# EAGLE design Astable 555 Timer (EAGLE 9.6.2)
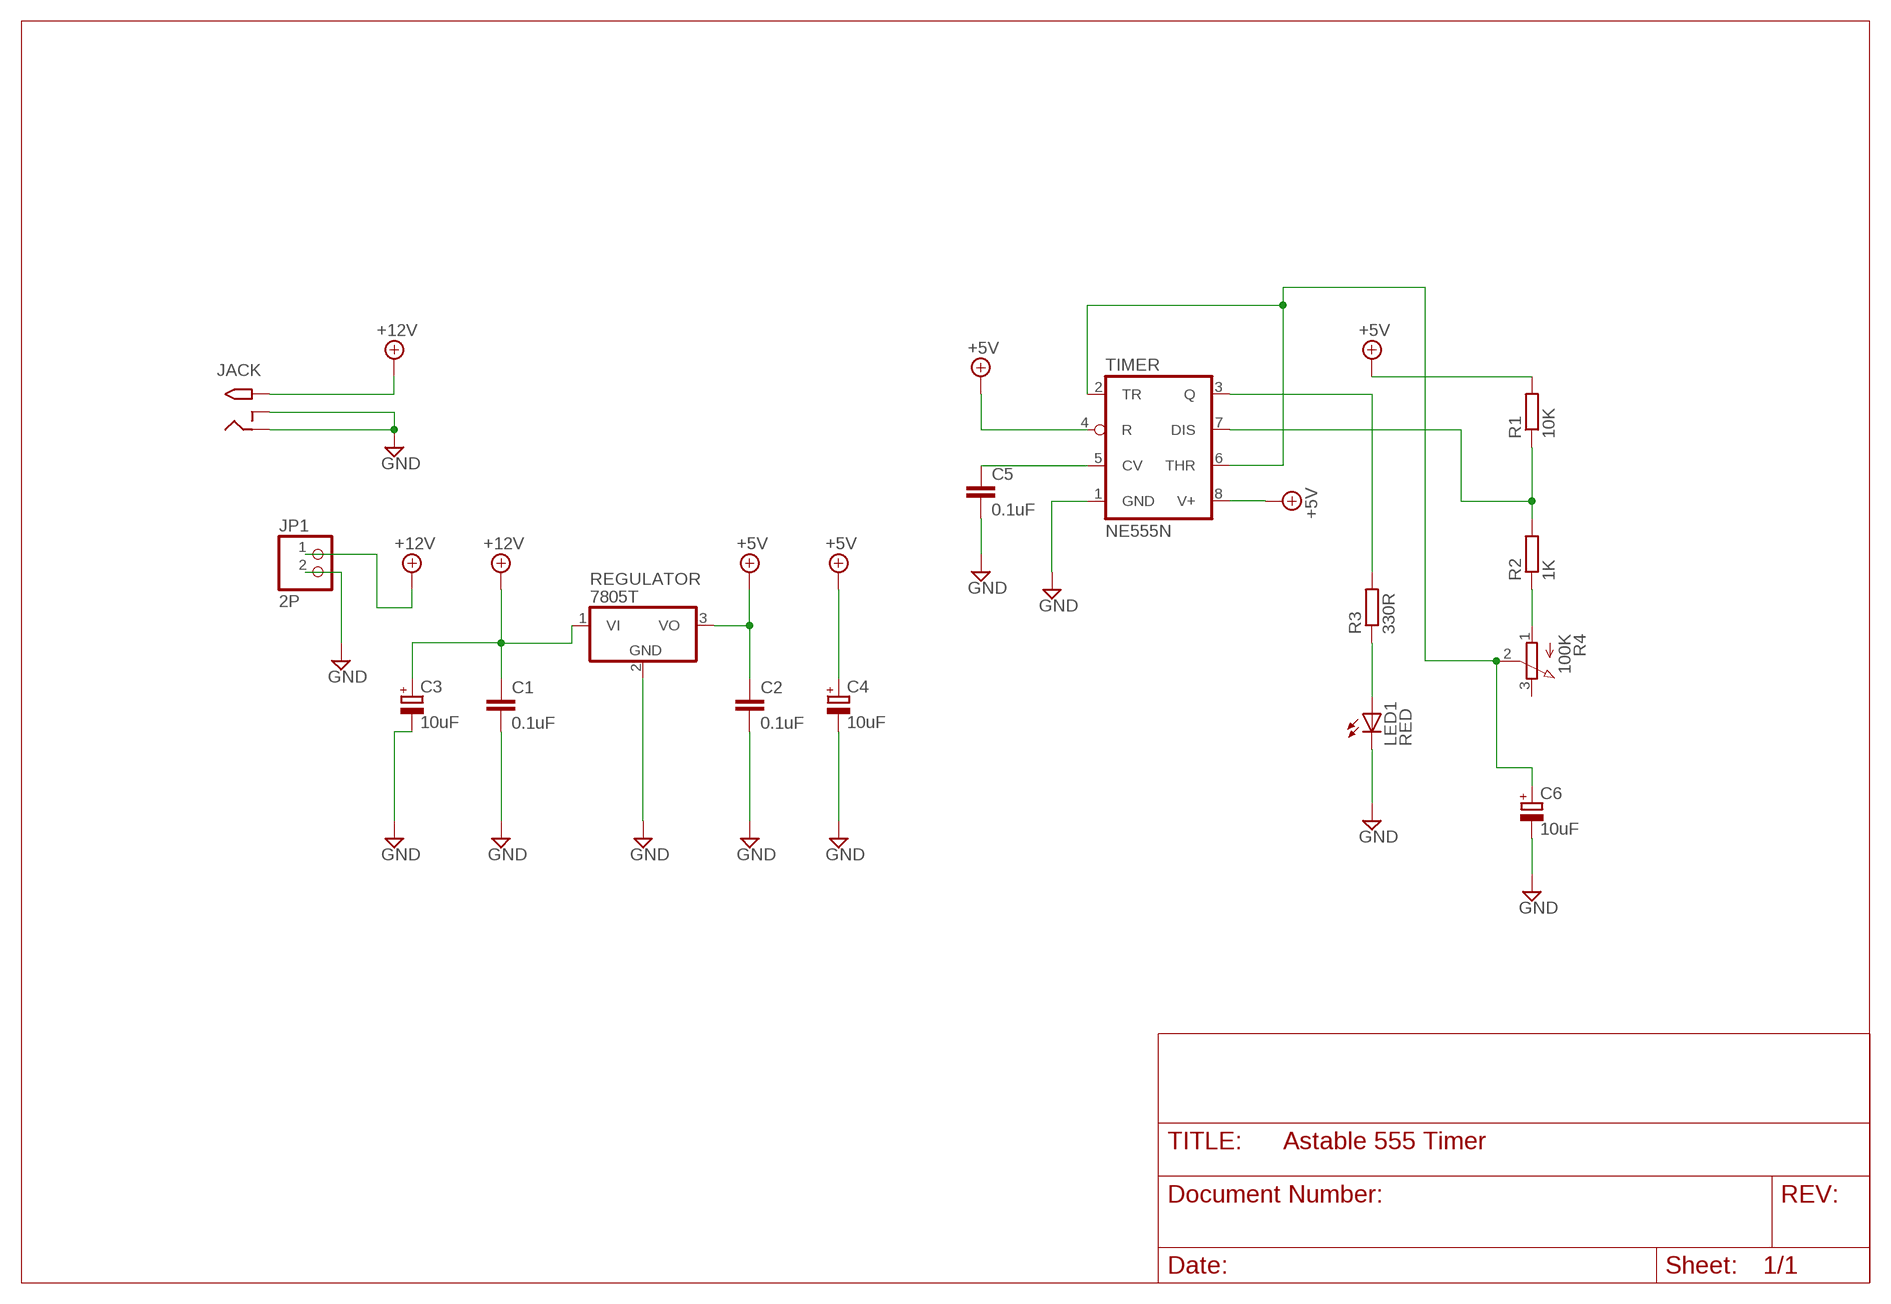
[diagram p0: schematic, sheet 1]

## Parts
C1  0.1uF  C-EU050-035X075  [C050-035X075]
C2  0.1uF  C-EU050-035X075  [C050-035X075]
C3  10uF  CPOL-EUE3.5-8  [E3,5-8]
C4  10uF  CPOL-EUE3.5-8  [E3,5-8]
C5  0.1uF  C-EU050-035X075  [C050-035X075]
C6  10uF  CPOL-EUE3.5-8  [E3,5-8]
JACK  2.1MMJACKTHM  [PJ-102A]
JP1  2P  PINHD-1X2  [1X02]
LED1  RED  LED5MM  [LED5MM]
R1  10K  R-EU_0207/15  [0207/15]
R2  1K  R-EU_0207/15  [0207/15]
R3  330R  R-EU_0207/15  [0207/15]
R4  100K  3RP/1610N  [3RP/1610N]
REGULATOR  7805T  [TO220H]
TIMER  NE555N  [DIL08-ROUND]

## Nets
+5V [POWER]: C2.1 C4.+ R1.2 REGULATOR.3(VO) TIMER.4(R) TIMER.8(V+)
+12V [POWER]: C1.1 C3.+ JACK.TIP JP1.1 REGULATOR.1(VI)
GND [POWER]: C1.2 C2.2 C3.- C4.- C5.2 C6.- JACK.RING JACK.RING_SW JP1.2 LED1.K(C) REGULATOR.2(GND) TIMER.1(GND)
N$1: C5.1 TIMER.5(CV)
N$2: R1.1 R2.2 TIMER.7(DIS)
N$3: C6.+ R4.2(S) TIMER.2(TR) TIMER.6(THR)
N$5: R3.2 TIMER.3(Q)
N$6: LED1.A R3.1
N$7: R2.1 R4.1(A)
Unconnected: R4.3(E)

## Library data of the parts
C1 C2 C5 = rcl:C-EU: CAPACITOR, European symbol; SPICEPREFIX: C
C3 C4 C6 = rcl:CPOL-EU: POLARIZED CAPACITOR, European symbol; SPICEPREFIX: C
JACK = adafruit:2.1MMJACK: 2.1mm x 5.5mm THM DC jack with internal switch. Digikey part #PJ-102A, 4UCON part #05537 2.1mm x 5.5mm SMT DC jack with internal switch. Digikey part #PJ-002A-SMT, 4UCON part #03267 By microbuilder.eu & adafruit.com
JP1 = pinhead:PINHD-1X2: PIN HEADER
LED1 = adafruit:LED: LED OSRAM: - CHIPLED LG R971, LG N971, LY N971, LG Q971, LY Q971, LO R971, LY R971 LH N974, LH R974 LS Q976, LO Q976, LY Q976 LO Q996 - Hyper CHIPLED LW Q18S LB Q993, LB Q99A, LB R99A - SideLED LS A670, LO A670, LY A670, LG A670, LP A670 LB A673, LV A673, LT A673, LW A673 LH A674 LY A675 LS A676, LA A676, LO A676, LY A676, LW A676 LS A679, LY A679, LG A679 - Hyper Micro SIDELED® LS Y876, LA Y876, LO Y876, LY Y876 LT Y87S - SmartLED LW L88C, LW L88S LB L89C, LB L89S, LG L890 LS L89K, LO L89K, LY L89K LS L896, LA L896, LO L896, LY L896 - TOPLED LS T670, LO T670, LY T670, LG T670, LP T670 LSG T670, LSP T670, LSY T670, LOP T670, LYG T670 LG T671, LOG T671, LSG T671 LB T673, LV T673, LT T673, LW T673 LH T674 LS T676, LA T676, LO T676, LY T676, LB T676, LH T676, LSB T676, LW T676 LB T67C, LV T67C, LT T67C, LS T67K, LO T67K, LY T67K, LW E67C LS E67B, LA E67B, LO E67B, LY E67B, LB E67C, LV E67C, LT E67C LW T67C LS T679, LY T679, LG T679 LS T770, LO T770, LY T770, LG T770, LP T770 LB T773, LV T773, LT T773, LW T773 LH T774 LS E675, LA E675, LY E675, LS T675 LS T776, LA T776, LO T776, LY T776, LB T776 LHGB T686 LT T68C, LB T68C - Hyper Mini TOPLED® LB M676 - Mini TOPLED Santana® LG M470 LS M47K, LO M47K, LY M47K Source: http://www.osram.convergy.de/
R1-R3 = rcl:R-EU_: RESISTOR, European symbol; SPICEPREFIX: R
R4 = pot:3RP/1610N: 16mm Potentiometer one level Source: http://www.alphapotentiometers.net/html/16mm_pot_2.html
REGULATOR = linear:78*: Positive VOLTAGE REGULATOR Source: http://cache.national.com/ds/LM/LM78L05.pdf http://www.fairchildsemi.com/ds/LM/LM7805.pdf
TIMER = adafruit:*555: TIMER Changed DIP package to have round (not oval) pin pads http://www.ladyada.net/library/pcb/eaglelibrary.html

## Net classes
0 default: width 0.305 mm, drill 0.305 mm, clearance 0.254 mm
1 POWER: width 0.406 mm, drill 0.406 mm, clearance 0.305 mm

## Board
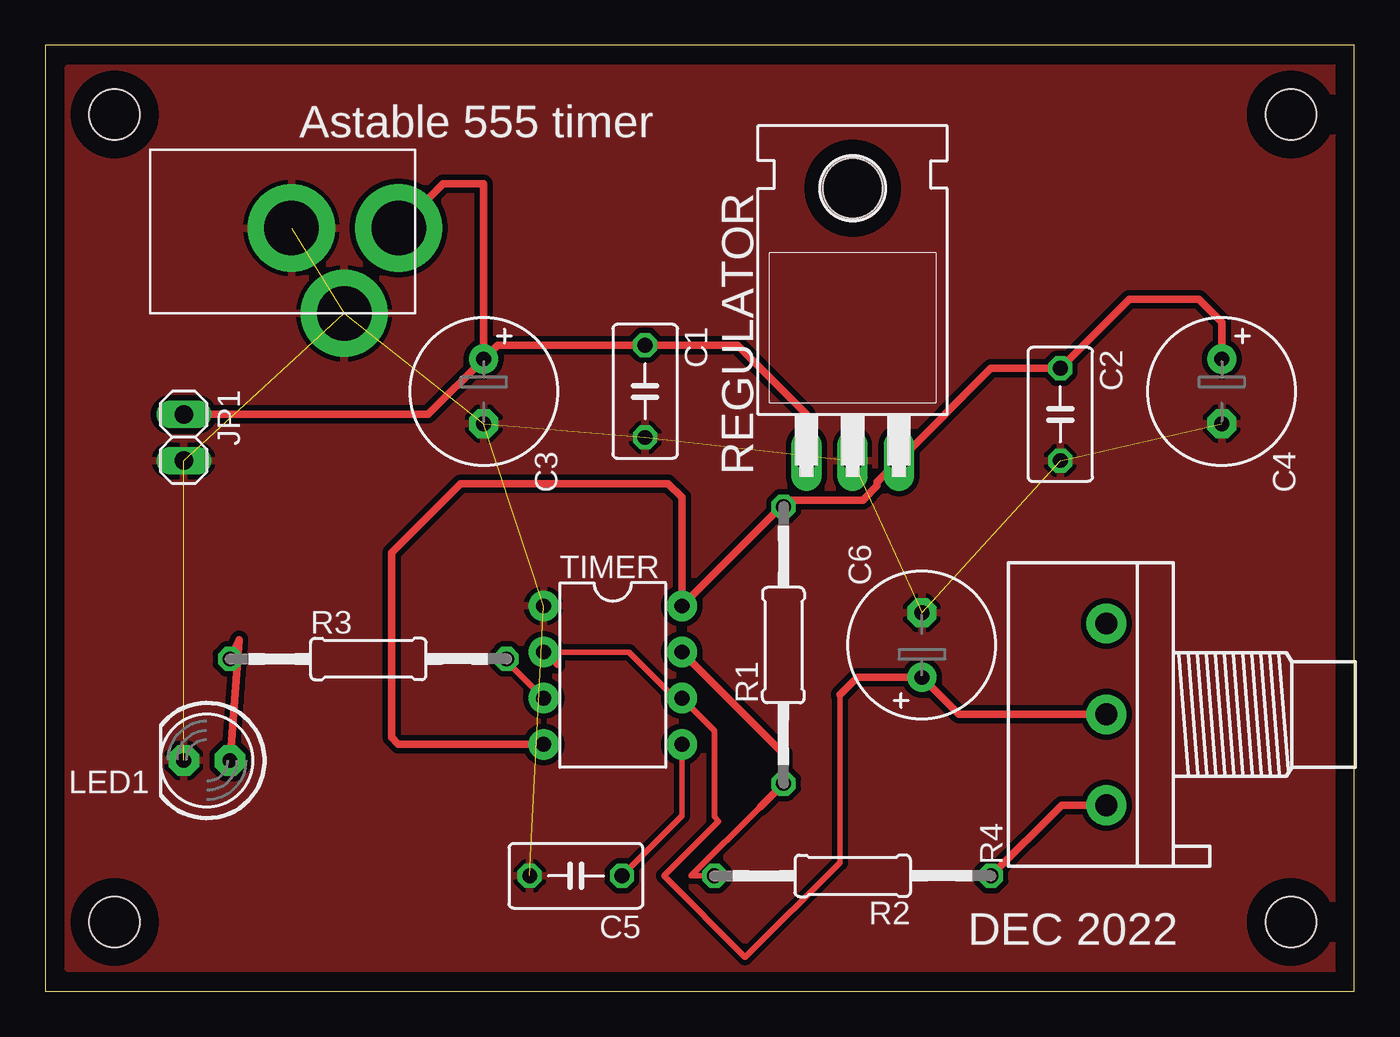
[diagram p1: board, top side]

Size 72.06 x 52.06 mm. Coordinates in mm from the lower left corner, seen from the top.
Outline: 0,0 72.06,0 72.06,52.06 0,52.06 0,0
Copper layers (1*16): Top 0.035mm / dielectric 1.5mm / Bottom 0.035mm
Design rules "default": minimum track width 6mil, minimum drill 0.35mm, track to track 6mil, track to pad 6mil, pad to pad 6mil, via to via 6mil, smd to smd 6mil, copper to edge 40mil, drill to drill 6mil, minimum pad ring 10mil, minimum via ring 8mil, stop-mask expansion 4mil, vias tented up to drill 0mil, thermal gap 10mil
Holes 2.8 mm at 3.81,48.26 68.58,48.26 68.58,3.81 3.81,3.81

### Footprints (pad centres in the part's own frame; a part is rotated, then mirrored left to right if it is on the bottom)
C050-035X075 = drill 0.813 octagon: 1 -2.54,0; 2 2.54,0
E3,5-8 = drill 0.813 pad 1.6: + -1.778,0 | drill 0.813 pad 1.6 octagon: - 1.778,0
PJ-102A = drill 3 pad 4.8: RING 0.1,-3.39; RING_SW -4.6,-6.29; TIP 0.1,-9.29
1X02 = drill 1.016 long: 1 -1.27,0; 2 1.27,0
LED5MM = drill 0.813 pad 1.676 octagon: A -1.27,0; K 1.27,0
0207/15 = drill 0.813 octagon: 1 -7.62,0; 2 7.62,0
3RP/1610N = drill 1.2 pad 2.184: 1 -5,0; 2 0,0; 3 5,0
TO220H = drill 1.118 long: 1 -2.54,-10.16; 2 0,-10.16; 3 2.54,-10.16 | hole 3.302: 0,4.826
DIL08-ROUND = drill 0.813 pad 1.676: 1 -3.81,-3.81; 2 -1.27,-3.81; 3 1.27,-3.81; 4 3.81,-3.81; 5 3.81,3.81; 6 1.27,3.81; 7 -1.27,3.81; 8 -3.81,3.81

### Placement (x,y rotation side)
C1  33.02,33.02 270 top
C2  55.88,31.75 270 top
C3  24.13,33.02 270 top
C4  64.77,33.02 270 top
C5  29.21,6.35 180 top
C6  48.26,19.05 90 top
JACK  10.16,41.91 90 top
JP1  7.62,30.48 270 top
LED1  8.89,12.7 180 top
R1  40.64,19.05 90 top
R2  44.45,6.35 180 top
R3  17.78,18.29 0 top
R4  58.42,15.24 90 top
REGULATOR  44.45,39.37 0 top
TIMER  31.24,17.4 270 top

### Tracks (layer width: path | path; a pad name or v marks a point on that pad's centre or on a via)
+5V
  Top 0.406: 35.56,21.59 35.43,21.59 TIMER.8 | C4.+ 64.77,36.83 63.5,38.1 59.69,38.1 C2.1 52.07,34.29 REGULATOR.3 45.8,28.02 45.8,27.81 45.01,27.03 41,27.03 R1.2 40.51,26.67 TIMER.8 | TIMER.8 35.05,27.18 34.29,27.94 22.86,27.94 19.05,24.13 19.05,13.97 19.43,13.59 TIMER.4
+12V
  Top 0.406: JACK.TIP 21.89,44.45 24.13,44.45 C3.+ | C3.+ 24.89,35.56 C1.1 38.1,35.56 41.91,31.75 REGULATOR.1 | C3.+ 21.08,31.75 JP1.1
GND  (11 unrouted)
  pour Top: 1.27,50.8 71.12,50.8 71.12,1.27 1.27,1.27
N$1
  Top 0.305: TIMER.5 35.05,9.65 C5.1
N$2
  Top 0.305: R2.2 35.56,6.35 39.37,10.16 39.52,10.31
  Top 0.406: 39.37,10.16 R1.1 40.64,13.08 TIMER.7
N$3
  Top 0.305: 43.74,16.31 43.74,7.08 38.53,1.87 34.05,6.35 37.06,9.36 36.83,9.6 36.83,14.35 TIMER.6 34.67,16.13 32.13,18.67 TIMER.2 28.17,17.93 28.17,18.38
  Top 0.406: R4.2 50.29,15.24 C6.+ 44.7,17.27 43.74,16.31
N$5
  Top 0.305: TIMER.3 25.4,18.16 R3.2
N$6
  Top 0.406: LED1.A 10.66,19.33 R3.1
N$7
  Top 0.406: R2.1 55.96,10.24 R4.1

### Text on the board
tNames: Astable 555 timer | DEC 2022